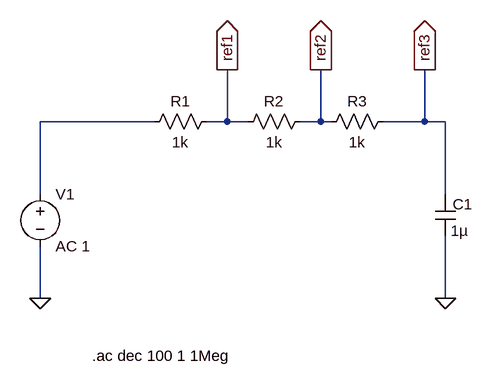
[diagram p0: schematic RC_cir_dotAc_fr_pr.asc]
RC_cir_dotAc_fr_pr.asc, the LTspice schematic file:
Version 4
SHEET 1 880 680
WIRE 192 208 16 208
WIRE 304 208 304 128
WIRE 304 208 272 208
WIRE 336 208 304 208
WIRE 448 208 448 128
WIRE 448 208 416 208
WIRE 464 208 448 208
WIRE 608 208 608 128
WIRE 608 208 544 208
WIRE 640 208 608 208
WIRE 16 320 16 208
WIRE 640 320 640 208
WIRE 16 480 16 400
WIRE 640 480 640 384
FLAG 16 480 0
FLAG 640 480 0
FLAG 304 128 ref1
IOPIN 304 128 Out
FLAG 448 128 ref2
IOPIN 448 128 Out
FLAG 608 128 ref3
IOPIN 608 128 Out
SYMBOL Res 288 192 R90
WINDOW 0 0 56 VBottom 2
WINDOW 3 32 56 VTop 2
SYMATTR InstName R1
SYMATTR Value 1k
SYMBOL Cap 624 320 R0
WINDOW 0 27 15 Left 2
SYMATTR InstName C1
SYMATTR Value 1µ
SYMBOL voltage 16 304 R0
SYMATTR InstName V1
SYMATTR Value AC 1
SYMBOL Res 432 192 R90
WINDOW 0 0 56 VBottom 2
WINDOW 3 32 56 VTop 2
SYMATTR InstName R2
SYMATTR Value 1k
SYMBOL Res 560 192 R90
WINDOW 0 0 56 VBottom 2
WINDOW 3 32 56 VTop 2
SYMATTR InstName R3
SYMATTR Value 1k
TEXT 96 568 Left 2 !.ac dec 100 1 1Meg

The netlist it stands for:
* RC_cir_dotAc_fr_pr.asc
R1 ref1 N001 1k
C1 ref3 0 1µ
V1 N001 0 AC 1
R2 ref2 ref1 1k
R3 ref3 ref2 1k
.ac dec 100 1 1Meg
.backanno
.end